# EAGLE design Light_Sensor_Card (EAGLE 6.4)

## Sheet 1 of 2
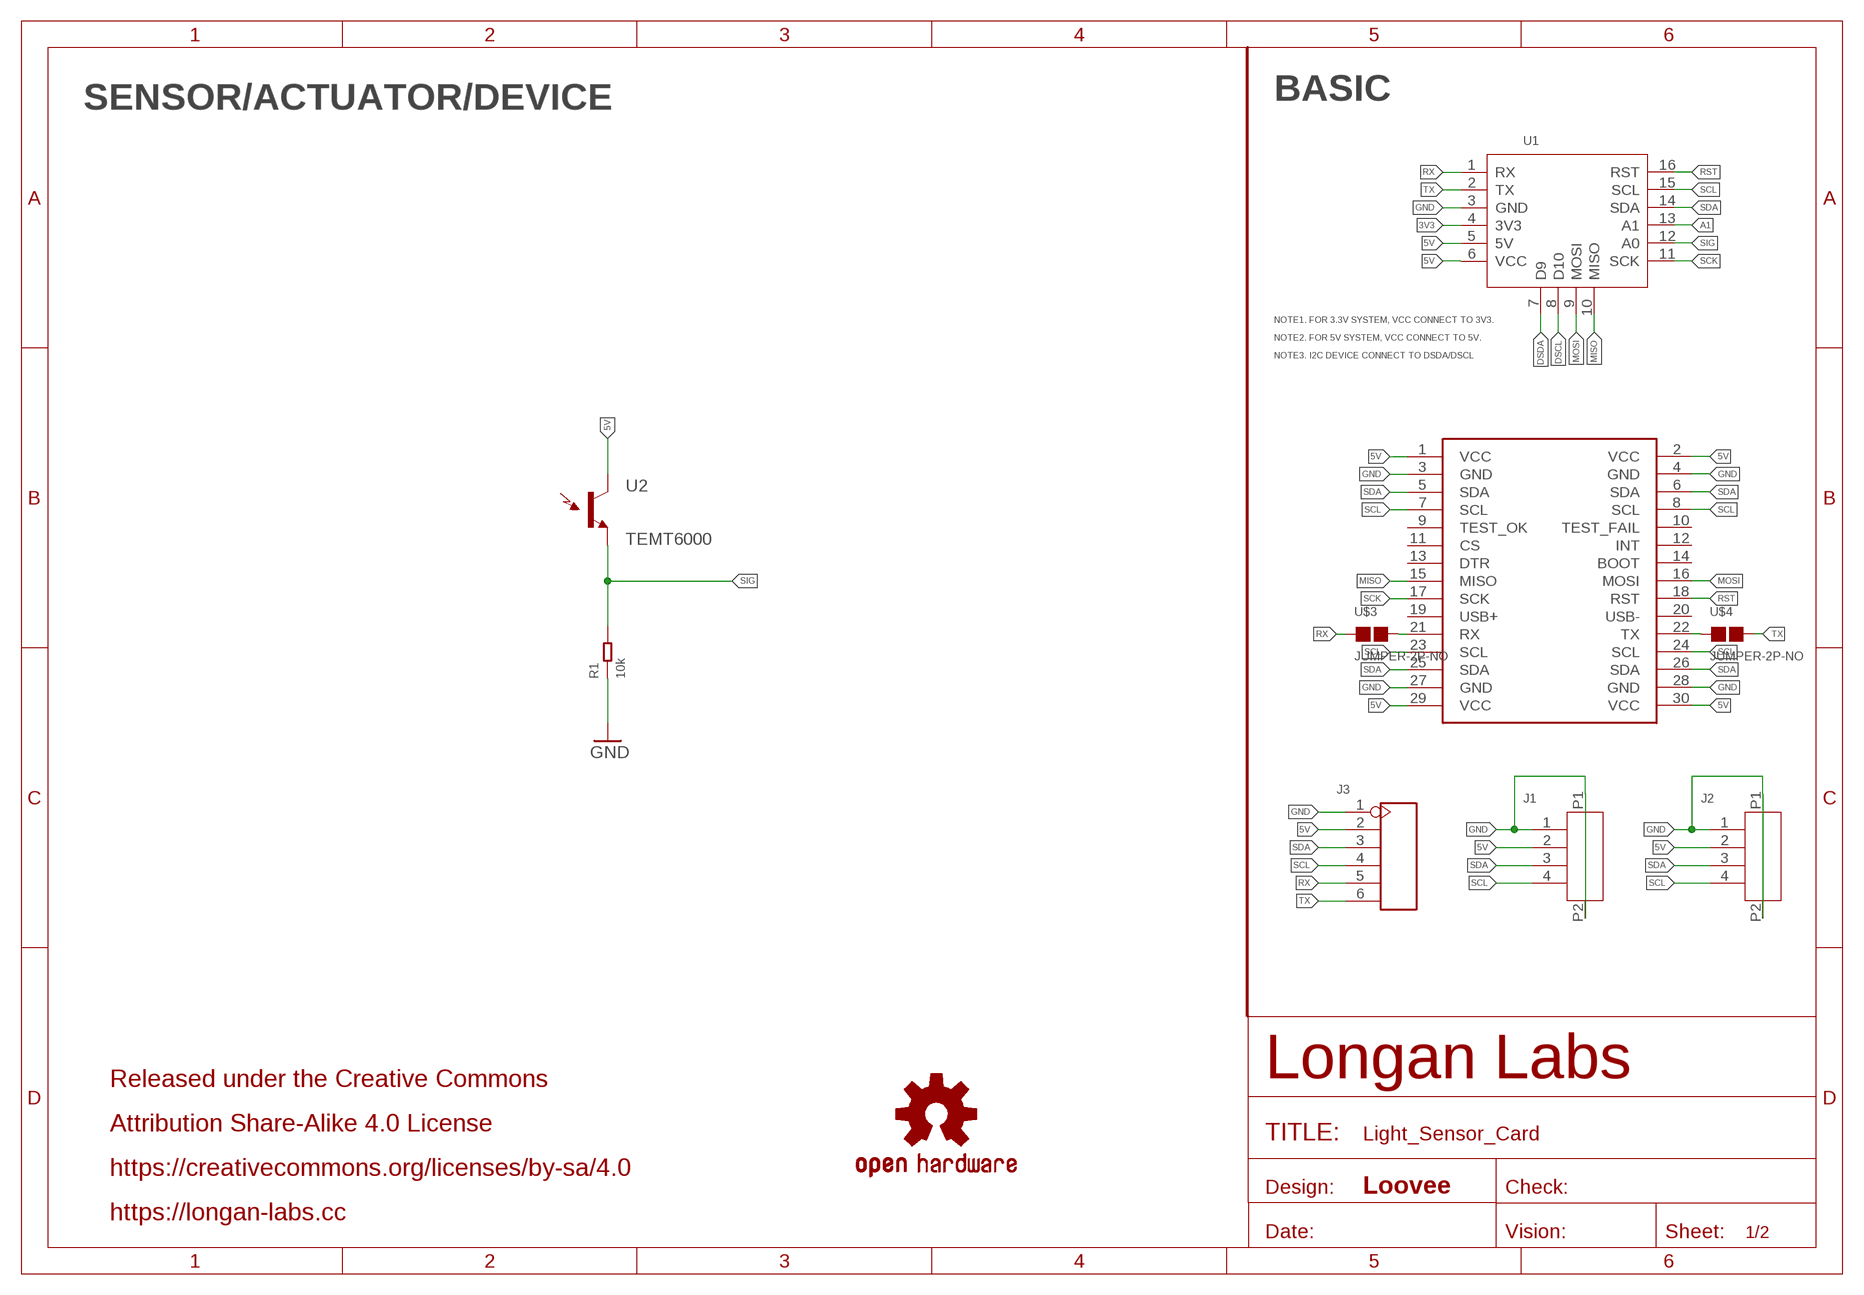
[diagram p0: schematic, sheet 1]

### Parts
J1  HEADER-4P-1.0  [4P-1.0-90D]
J2  HEADER-4P-1.0  [4P-1.0-90D]
J3  HEADER-6P-55/35MIL  [H6-2.54]
LOGO2  OSHW-LOGOS  [OSHW-LOGO-S]
MOUDLE1  MOUDLE-2X15P-2.54'BOARD'  [MOUDLE-2X15P-2.54]
R1  10k  RES-0603  [R0603]
U1  MOUDLE-CARDS  [16P-2.0-CARDS]
U2  TEMT6000  [TEMT6000-SEN]
U$3  JUMPER-2P-NO  [2P-SMD-NO]
U$4  JUMPER-2P-NO  [2P-SMD-NO]

### Nets
3V3: U1.4(3V3)
5V: J1.2 J2.2 J3.2 MOUDLE1.1(VCC) MOUDLE1.2(VCC) MOUDLE1.29(VCC) MOUDLE1.30(VCC) U1.5(5V) U1.6(VCC) U2.COLLECTOR(C1)
A1: U1.13(A1)
DSCL: U1.8(D10)
DSDA: U1.7(D9)
GND: J1.1 J1.P1 J1.P2 J2.1 J2.P1 J2.P2 J3.1 MOUDLE1.3(GND) MOUDLE1.4(GND) MOUDLE1.27(GND) MOUDLE1.28(GND) R1.1 U1.3(GND)
MISO: MOUDLE1.15(MISO) U1.10(MISO)
MOSI: MOUDLE1.16(MOSI) U1.9(MOSI)
N$1: MOUDLE1.21(RX) U$3.2
N$2: MOUDLE1.22(TX) U$4.1
RST: MOUDLE1.18(RST) U1.16(RST)
RX: J3.5 U1.1(RX) U$3.1
SCK: MOUDLE1.17(SCK) U1.11(SCK)
SCL: J1.4 J2.4 J3.4 MOUDLE1.7(SCL) MOUDLE1.8(SCL) MOUDLE1.23(SCL) MOUDLE1.24(SCL) U1.15(SCL)
SDA: J1.3 J2.3 J3.3 MOUDLE1.5(SDA) MOUDLE1.6(SDA) MOUDLE1.25(SDA) MOUDLE1.26(SDA) U1.14(SDA)
SIG: R1.2 U1.12(A0) U2.EMITTER(E1)
TX: J3.6 U1.2(TX) U$4.2
Unconnected: MOUDLE1.9(TEST_OK) MOUDLE1.10(TEST_FAIL) MOUDLE1.11(CS) MOUDLE1.12(INT) MOUDLE1.13(DTR) MOUDLE1.14(BOOT) MOUDLE1.19(USB+) MOUDLE1.20(USB-)

### Notes on the sheet
- SENSOR/ACTUATOR/DEVICE | BASIC
- NOTE1. FOR 3.3V SYSTEM, VCC CONNECT TO 3V3.
- NOTE2. FOR 5V SYSTEM, VCC CONNECT TO 5V.
- NOTE3. I2C DEVICE CONNECT TO DSDA/DSCL
- Released under the Creative Commons
- Attribution Share-Alike 4.0 License
- https://creativecommons.org/licenses/by-sa/4.0
- Loovee
- https://longan-labs.cc

## Sheet 2 of 2

## Library data of the parts
J1 J2 = Longan-Connect:HEADER-4P-1.0
J3 = Connector-new:HEADER-6P
LOGO2 = SparkFun-Aesthetics:OSHW-LOGO: Open-Source Hardware (OSHW) Logo This logo indicates the piece of hardware it is found on incorporates a OSHW license and/or adheres to the definition of open source hardware found here: http://freedomdefined.org/OSHW
MOUDLE1 = Longan-moudle:MOUDLE-2X15P-2.54
R1 = Discrete-new:RES
U1 = MOUDLE-CARDS:MOUDLE-CARDS
U2 = SparkFun:TEMT6000: Ambient Light Sensor Simple light detection sensor. Output varies with light intensity input. Spark Fun Electronics SKU : COM-08348
U$3 U$4 = Discrete-new:JUMPER-2P-NO

## Board
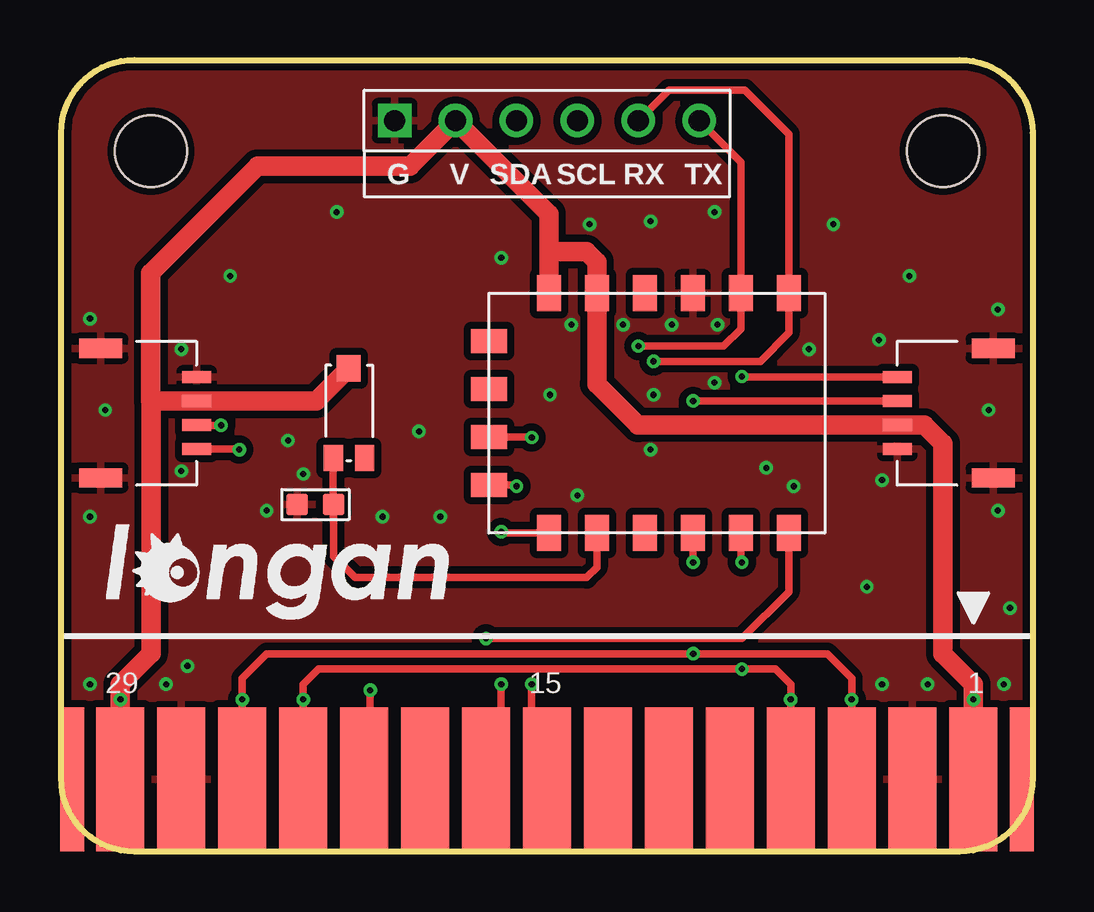
[diagram p1: board, top side]
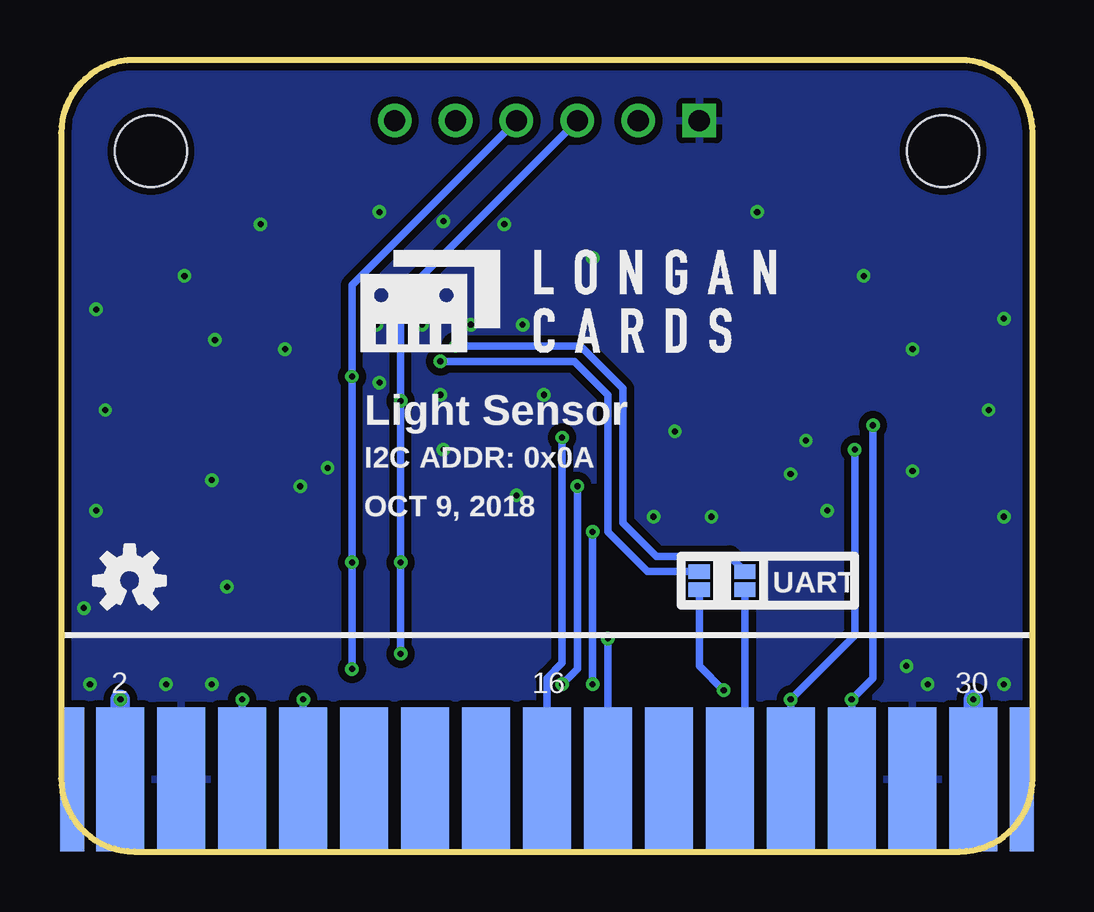
[diagram p2: board, bottom side, seen from below]

Size 40.5 x 33 mm. Coordinates in mm from the lower left corner, seen from the top.
Copper layers (1*16): Top 0.035mm / dielectric 1.5mm / Bottom 0.035mm
Design rules "SeeedStudio_2layer_DRU_no_angle_20140221 *": minimum track width 6mil, minimum drill 10mil, track to track 6mil, track to pad 6mil, pad to pad 6mil, via to via 6mil, smd to smd 0mil, copper to edge 10mil, drill to drill 10mil, minimum pad ring 10mil, minimum via ring 6mil, stop-mask expansion 2mil, vias tented up to drill 25mil, thermal gap 10mil

### Footprints (pad centres in the part's own frame; a part is rotated, then mirrored left to right if it is on the bottom)
4P-1.0-90D = smd 1.2 x 0.5: 1 0,1.5; 2 0,0.5; 3 0,-0.5; 4 0,-1.5 | smd 1.8 x 0.8: P1 -4,2.7; P2 -4,-2.7
H6-2.54 = drill 0.889 pad 1.397 square: 1 0,6.35 | drill 0.889 pad 1.397: 2 0,3.81; 3 0,1.27; 4 0,-1.27; 5 0,-3.81; 6 0,-6.35
MOUDLE-2X15P-2.54 = smd 2 x 6: 1 17.78,-13.492; 3 15.24,-13.492; 5 12.7,-13.492; 7 10.16,-13.492; 9 7.62,-13.492; 11 5.08,-13.492; 13 2.54,-13.492; 15 0,-13.492; 17 -2.54,-13.492; 19 -5.08,-13.492; 21 -7.62,-13.492; 23 -10.16,-13.492; 25 -12.7,-13.492; 27 -15.24,-13.492; 29 -17.78,-13.492 | smd 2 x 6 bottom: 2 17.78,-13.492; 4 15.24,-13.492; 6 12.7,-13.492; 8 10.16,-13.492; 10 7.62,-13.492; 12 5.08,-13.492; 14 2.54,-13.492; 16 0,-13.492; 18 -2.54,-13.492; 20 -5.08,-13.492; 22 -7.62,-13.492; 24 -10.16,-13.492; 26 -12.7,-13.492; 28 -15.24,-13.492; 30 -17.78,-13.492 | smd 1 x 6: P1 -19.8,-13.492; P4 19.8,-13.492 | smd 1 x 6 bottom: P2 -19.8,-13.492; P3 19.8,-13.492 | hole 3: -16.51,12.7; 16.51,12.7
R0603 = smd 0.889 x 0.889: 1 0,0.762; 2 0,-0.762
16P-2.0-CARDS = smd 1.5 x 1: 1 -5,5; 2 -5,3; 3 -5,1; 4 -5,-1; 5 -5,-3; 6 -5,-5; 11 5,-5; 12 5,-3; 13 5,-1; 14 5,1; 15 5,3; 16 5,5 | smd 1 x 1.5: 7 -3,-7.5; 8 -1,-7.5; 9 1,-7.5; 10 3,-7.5
TEMT6000-SEN = smd 1.1 x 0.8: BASE -1.87,-0.65; EMITTER -1.87,0.65 | smd 1.1 x 1: COLLECTOR 1.86,0.01
2P-SMD-NO = smd 0.889 x 0.61: 1 0,0.381; 2 0,-0.381

### Placement (x,y rotation side)
J1  5.64,18.28 0 top
J2  34.86,18.28 180 top
J3  20.25,30.47 90 top
LOGO2  37.65,11.29 0 bottom
MOUDLE1  20.25,16.5 0 top
R1  10.6,14.47 90 top
U1  25.33,18.28 270 top
U2  11.99,18.28 90 top
U$1  [LONGAN-CARDS-MIDDLE]  28.76,20.31 0 bottom
U$2  [LONGAN-SILK-SMALLER]  0.57,8.5 0 top
U$3  13.9,11.29 0 bottom
U$4  11.99,11.29 180 bottom

### Tracks (layer width: path | path; a pad name or v marks a point on that pad's centre or on a via)
5V  (via drill 0.25 pad 0.51)
  Top 0.152: U1.6 20.33,23.95
  Top 0.508: U1.5 22.33,23.15 | 38.03,6.47 v38.03,6.34
  Top 0.813: 3.75,18.78 3.75,8.25 2.47,6.97 v2.47,6.34 MOUDLE1.30 | 22.33,23.15 22.33,19.5 24.05,17.78 J2.2 35.99,17.78 36.76,17.01 36.76,8.24 38.03,6.97 38.03,6.47 | v38.03,6.34 MOUDLE1.2 | 3.75,18.78 J1.2 10.62,18.78 U2.COLLECTOR | 3.75,18.78 3.74,18.79 3.74,24.12 8.19,28.56 14.54,28.56 J3.2 20.33,26.58 20.33,25.14 | 22.33,23.15 22.41,23.23 | 20.33,23.95 20.33,25.14 | 22.33,23.15 22.33,24.58 21.9,25.01 20.46,25.01 20.33,25.14
  Bottom 0.813: v2.47,6.34 MOUDLE1.30 | v38.03,6.34 MOUDLE1.2
GND  (via drill 0.25 pad 0.51)
  other vias: 34.22,6.97 36.12,6.97 39.3,6.97 4.38,6.97 5.26,7.74 1.2,6.97 1.84,18.41 5.01,15.87 1.2,13.96 1.2,22.21 5.01,20.95 18.34,24.76 21.27,21.96 25.46,21.96 27.36,21.96 23.43,21.96 24.7,19.04 27.23,19.55 20.38,19.04 21.52,14.85 24.57,16.75 29.39,15.99 30.54,15.23 38.66,18.41 39.05,22.6 39.05,14.21 34.22,15.48 34.09,21.33 27.23,26.66 24.57,26.28 22.03,26.15 31.17,20.95 32.19,26.15 35.36,23.99 33.59,11.04 39.55,10.15 9.46,17.14 10.09,15.74 8.57,14.21 13.39,13.96 15.8,13.96 7.04,23.99 11.49,26.66 14.92,17.52
  pour Top (isolate 0.305): -0.07,33.01 40.57,33.01 40.57,-0.01 -0.07,-0.01
  pour Bottom (isolate 0.305): -0.07,33.01 40.57,33.01 40.57,-0.01 -0.07,-0.01
MISO  (via drill 0.25 pad 0.51)
  Top 0.305: U1.10 18.93,15.28 v18.98,15.23 | v19.61,6.97 19.61,3.64 MOUDLE1.15
  Bottom 0.305: v18.98,15.23 18.98,7.61 v19.61,6.97
MOSI  (via drill 0.25 pad 0.51)
  Top 0.305: U1.9 19.6,17.28 v19.61,17.26
  Bottom 0.305: v19.61,17.26 19.61,7.86 20.25,7.23 MOUDLE1.16
N$1  (via drill 0.25 pad 0.51)
  Top 0.305: v12.88,6.72 12.88,3.26 MOUDLE1.21
  Bottom 0.305: U$3.2 13.9,7.74 v12.88,6.72
N$2
  Bottom 0.305: U$4.1 11.99,3.64 MOUDLE1.22
RST  (via drill 0.25 pad 0.51)
  Top 0.305: U1.16 30.33,10.83 28.38,8.88 v17.71,8.88
  Bottom 0.305: v17.71,8.88 MOUDLE1.18
RX  (via drill 0.25 pad 0.51)
  Top 0.305: J3.5 25.33,31.74 28.51,31.74 30.33,29.91 U1.1 30.33,21.63 29.14,20.44 v24.7,20.44
  Bottom 0.305: v24.7,20.44 19.11,20.44 17.71,19.04 17.71,13.32 16.06,11.67 U$3.1
SCK  (via drill 0.25 pad 0.51)
  Top 0.305: U1.11 18.39,13.28 v18.34,13.32 | v18.34,6.97 18.34,3.64 MOUDLE1.17
  Bottom 0.305: v18.34,13.32 v18.34,6.97
SCL  (via drill 0.25 pad 0.51)
  Top 0.305: MOUDLE1.8 v30.41,6.34 30.41,6.97 29.77,7.61 v28.38,7.61 10.72,7.61 10.09,6.97 v10.09,6.34 MOUDLE1.23 | U1.15 28.33,12.1 v28.38,12.05 | J2.4 28.4,19.78 v28.38,19.8 | J1.4 7.4,16.78 v7.42,16.75
  Bottom 0.305: MOUDLE1.23 v10.09,6.34 7.42,9.01 v7.42,16.75 | v30.41,6.34 MOUDLE1.8 | J3.4 28.38,23.61 v28.38,19.8 v28.38,12.05 v28.38,7.61
SDA  (via drill 0.25 pad 0.51)
  Top 0.305: MOUDLE1.6 v32.95,6.34 32.95,7.23 31.93,8.24 v26.35,8.24 8.57,8.24 7.55,7.23 v7.55,6.34 MOUDLE1.25 | U1.14 26.33,12.07 v26.35,12.05 | J2.3 26.35,18.78 v26.35,18.79 | v6.66,17.77 5.65,17.77 J1.3
  Bottom 0.305: MOUDLE1.25 v7.55,6.34 6.66,7.23 v6.66,17.77 | v32.95,6.34 MOUDLE1.6 | J3.3 26.35,23.1 v26.35,18.79 v26.35,12.05 v26.35,8.24
SIG
  Top 0.305: U1.12 22.33,11.85 21.9,11.42 12.25,11.42 11.36,12.31 R1.2 11.35,13.97 U2.EMITTER
TX  (via drill 0.25 pad 0.51)
  Top 0.305: J3.6 28.33,28.74 U1.2 28.33,21.79 27.62,21.07 v24.06,21.07
  Bottom 0.305: v24.06,21.07 18.85,21.07 17.07,19.29 17.07,13.71 15.68,12.31 12.63,12.31 U$4.2

### Text on the board
tPlace: G | V | SDA | SCL | RX | TX
bPlace: Light Sensor | I2C ADDR: 0x0A | OCT 9, 2018 | UART